# EAGLE design Nokia1600 (EAGLE 7.2.0)
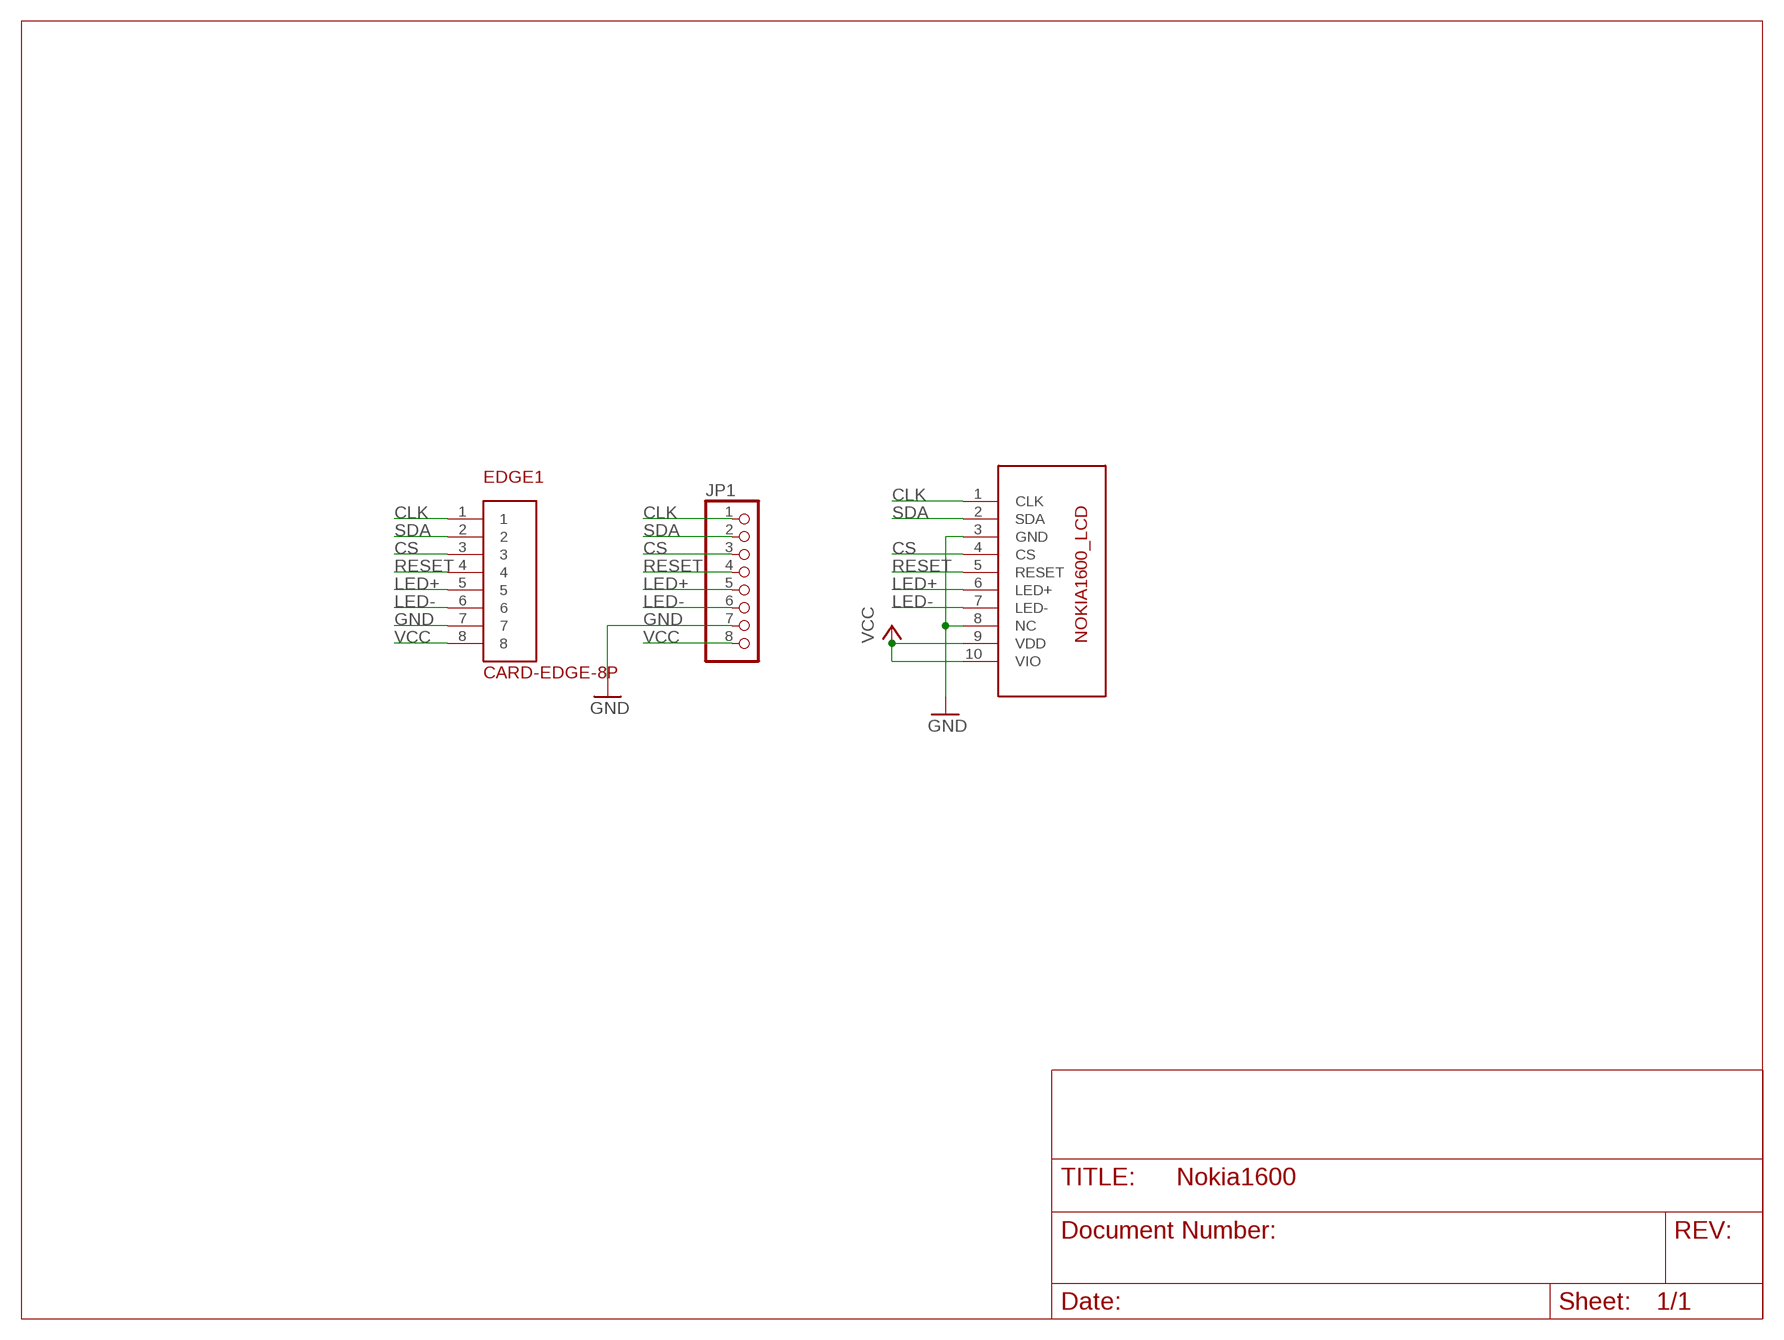
[diagram p0: schematic, sheet 1]

## Parts
EDGE1  CARD-EDGE-8P  DUOPLUG-8P-KEYEDCARD-EDGE-8P  [DUOPLUG-8P-KEYED]
JP1  HEADER-1X8ROUND  [1X08_ROUND]
U$1  NOKIA1600_LCD  [NOKIA1600_LCD]

## Nets
CLK: EDGE1.1 JP1.1 U$1.1(CLK)
CS: EDGE1.3 JP1.3 U$1.4(CS)
GND [power]: EDGE1.7 JP1.7 U$1.3(GND) U$1.8(NC)
LED+ [power]: EDGE1.5 JP1.5 U$1.6(LED+)
LED-: EDGE1.6 JP1.6 U$1.7(LED-)
RESET: EDGE1.4 JP1.4 U$1.5(RESET)
SDA: EDGE1.2 JP1.2 U$1.2(SDA)
VCC [power]: EDGE1.8 JP1.8 U$1.9(VDD) U$1.10(VIO)

## Library data of the parts
EDGE1 = SistemaCendit11713v2:DUOPLUG-8P-KEYED
JP1 = microbuilder:HEADER-1X8: PIN HEADER
U$1 = PeterAtMega644:NOKIA1600_LCD

## Net classes
0 default: width 0.203 mm, drill 0.305 mm, clearance 0.152 mm
1 power: width 0.203 mm, drill 0.305 mm, clearance 0.152 mm

## Board
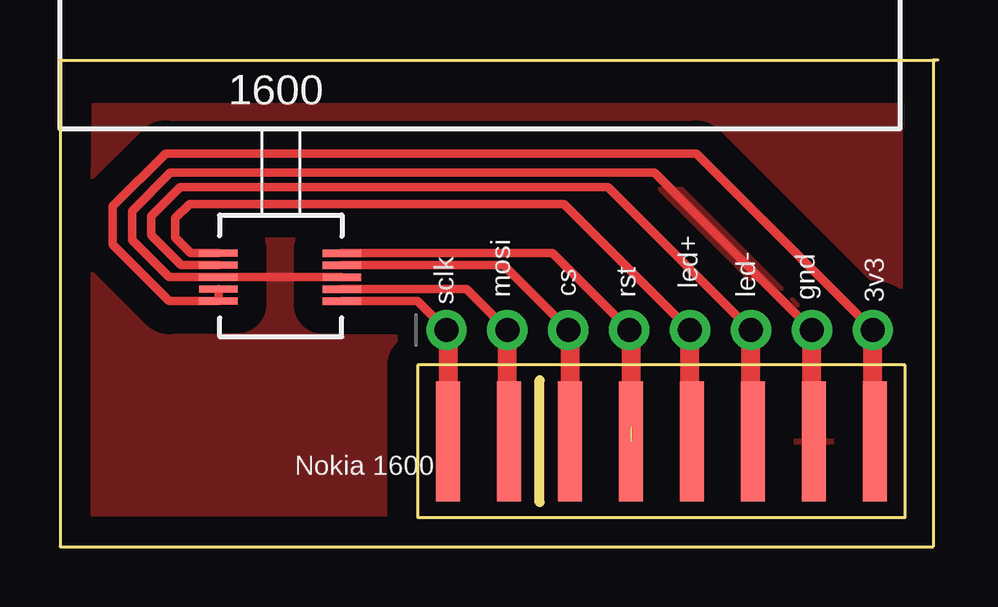
[diagram p1: board, top side]

Size 36.6 x 20.3 mm. Coordinates in mm from the lower left corner, seen from the top.
Outline: 36.5,20.3 0,20.3 0,0 36.4,0 36.4,20.3 36.6,20.3
Copper layers (1*16): Top 0.035mm / dielectric 1.5mm / Bottom 0.035mm
Design rules "Fusion_eagle_rule_v1.1": minimum track width 6mil, minimum drill 12mil, track to track 6mil, track to pad 6mil, pad to pad 6mil, via to via 6mil, smd to smd 0mil, copper to edge 10mil, drill to drill 10mil, minimum pad ring 10mil, minimum via ring 6mil, stop-mask expansion 2mil, vias tented up to drill 100mil, thermal gap 10mil

### Footprints (pad centres in the part's own frame; a part is rotated, then mirrored left to right if it is on the bottom)
DUOPLUG-8P-KEYED = smd 5 x 1: 1 0,7.62; 2 0,5.08; 3 0,2.54; 4 0,0; 5 0,-2.54; 6 0,-5.08; 7 0,-7.62; 8 0,-10.16
1X08_ROUND = drill 1 pad 1.676: 1 -8.89,0; 2 -6.35,0; 3 -3.81,0; 4 -1.27,0; 5 1.27,0; 6 3.81,0; 7 6.35,0; 8 8.89,0
NOKIA1600_LCD = smd 1.6 x 0.3: 1 23.255,40.961; 2 23.255,40.461; 3 23.255,39.961; 4 23.255,39.461; 5 23.255,38.961; 6 28.389,38.953; 7 28.389,39.453; 8 28.389,39.953; 9 28.389,40.453; 10 28.389,40.953

### Placement (x,y rotation side)
EDGE1  23.8,4.4 90 top
JP1  25,9.04 0 top
U$1  35,51.2 180 top

### Tracks (layer width: path | path; a pad name or v marks a point on that pad's centre or on a via)
CLK
  Top 0.35: U$1.1 14.91,10.24 JP1.1
  Top 0.8: JP1.1 16.18,9.04 EDGE1.1
CS
  Top 0.35: U$1.4 18.49,11.74 JP1.3
  Top 0.8: JP1.3 21.26,9.04 EDGE1.3
GND
  Top 0.35: JP1.7 24.79,15.6 4.6,15.6 3,14 3,12.8 4.55,11.25 U$1.8 U$1.3
  Top 0.8: EDGE1.7 31.35,4.4 JP1.7
  pour Top (isolate 1.2): 1.2,1.2 35.6,1.2 35.8,18.4 1.4,18.4
LED+
  Top 0.35: U$1.6 5.45,12.25 4.8,12.9 4.8,13.7 5.4,14.3 21.01,14.3 JP1.5
  Top 0.8: EDGE1.5 26.27,4.4 JP1.5
LED-
  Top 0.35: U$1.7 5.05,11.75 3.8,13 3.8,13.8 5,15 22.85,15 JP1.6
  Top 0.8: EDGE1.6 28.81,4.4 JP1.6
RESET  (1 unrouted)
  Top 0.35: U$1.5 20.53,12.24 JP1.4
  Top 0.8: JP1.4 23.8,9.04 23.8,5
SDA
  Top 0.35: U$1.2 16.95,10.74 JP1.2
  Top 0.8: EDGE1.2 18.65,4.4 JP1.2
VCC
  Top 0.35: U$1.9 U$1.10 4.55,10.25 2.2,12.6 2.2,14.2 4.4,16.4 26.53,16.4 JP1.8
  Top 0.8: EDGE1.8 33.89,4.4 JP1.8

### Text on the board
tPlace: Nokia 1600
tNames: led+ | cs | sclk | mosi | rst | led- | gnd | 3v3